# EAGLE design logic_translator (EAGLE 7.7.0)
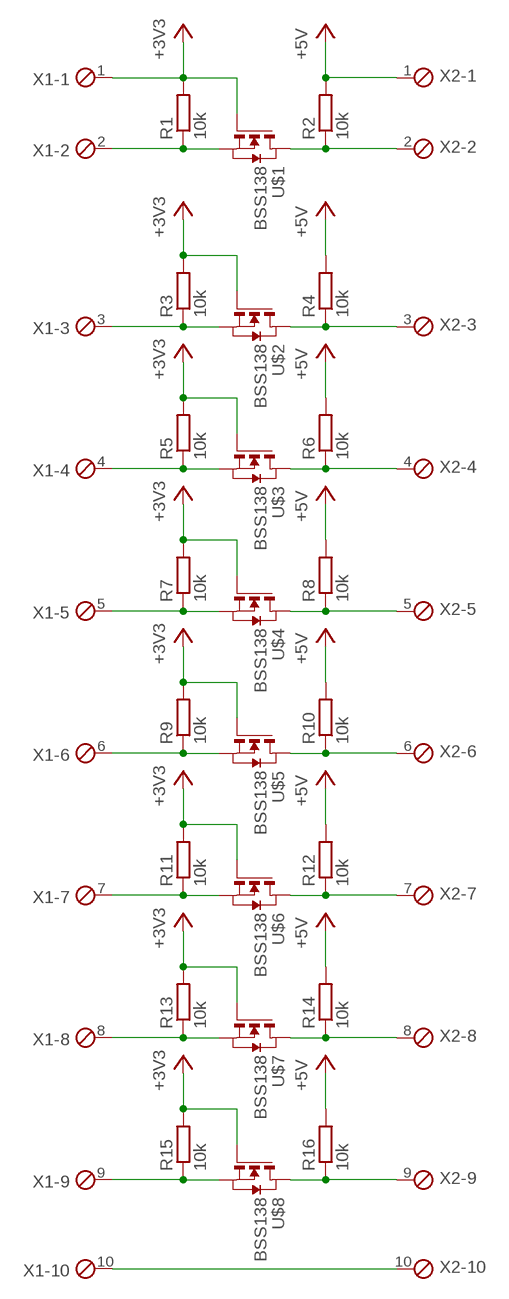
[diagram p0: schematic, sheet 1]

## Parts
R1  10k  R-EU_R1206  [R1206]
R2  10k  R-EU_R1206  [R1206]
R3  10k  R-EU_R1206  [R1206]
R4  10k  R-EU_R1206  [R1206]
R5  10k  R-EU_R1206  [R1206]
R6  10k  R-EU_R1206  [R1206]
R7  10k  R-EU_R1206  [R1206]
R8  10k  R-EU_R1206  [R1206]
R9  10k  R-EU_R1206  [R1206]
R10  10k  R-EU_R1206  [R1206]
R11  10k  R-EU_R1206  [R1206]
R12  10k  R-EU_R1206  [R1206]
R13  10k  R-EU_R1206  [R1206]
R14  10k  R-EU_R1206  [R1206]
R15  10k  R-EU_R1206  [R1206]
R16  10k  R-EU_R1206  [R1206]
U$1  BSS138  [SOT-23]
U$2  BSS138  [SOT-23]
U$3  BSS138  [SOT-23]
U$4  BSS138  [SOT-23]
U$5  BSS138  [SOT-23]
U$6  BSS138  [SOT-23]
U$7  BSS138  [SOT-23]
U$8  BSS138  [SOT-23]
X1  MPT10  [10POL254]
X2  MPT10  [10POL254]

## Nets
+3V3: R1.2 R3.2 R5.2 R7.2 R9.2 R11.2 R13.2 R15.2 U$1.3(G) U$2.3(G) U$3.3(G) U$4.3(G) U$5.3(G) U$6.3(G) U$7.3(G) U$8.3(G) X1.1
+5V: R2.2 R4.2 R6.2 R8.2 R10.2 R12.2 R14.2 R16.2 X2.1
N$1: R1.1 U$1.2(S) X1.2
N$2: R3.1 U$2.2(S) X1.3
N$3: R2.1 U$1.1(D) X2.2
N$4: R4.1 U$2.1(D) X2.3
N$5: R5.1 U$3.2(S) X1.4
N$6: R6.1 U$3.1(D) X2.4
N$7: R7.1 U$4.2(S) X1.5
N$8: R8.1 U$4.1(D) X2.5
N$9: R9.1 U$5.2(S) X1.6
N$10: R10.1 U$5.1(D) X2.6
N$11: R11.1 U$6.2(S) X1.7
N$12: R12.1 U$6.1(D) X2.7
N$13: R13.1 U$7.2(S) X1.8
N$14: R14.1 U$7.1(D) X2.8
N$15: R15.1 U$8.2(S) X1.9
N$16: R16.1 U$8.1(D) X2.9
N$17: X1.10 X2.10

## Library data of the parts
R1-R16 = rcl:R-EU_: RESISTOR, European symbol
U$1-U$8 = my_electronics_library:BSS138
X1 X2 = con-phoenix-254:MPT10: PHOENIX CONNECTOR; OC_FARNELL: unknown; OC_NEWARK: unknown

## Board
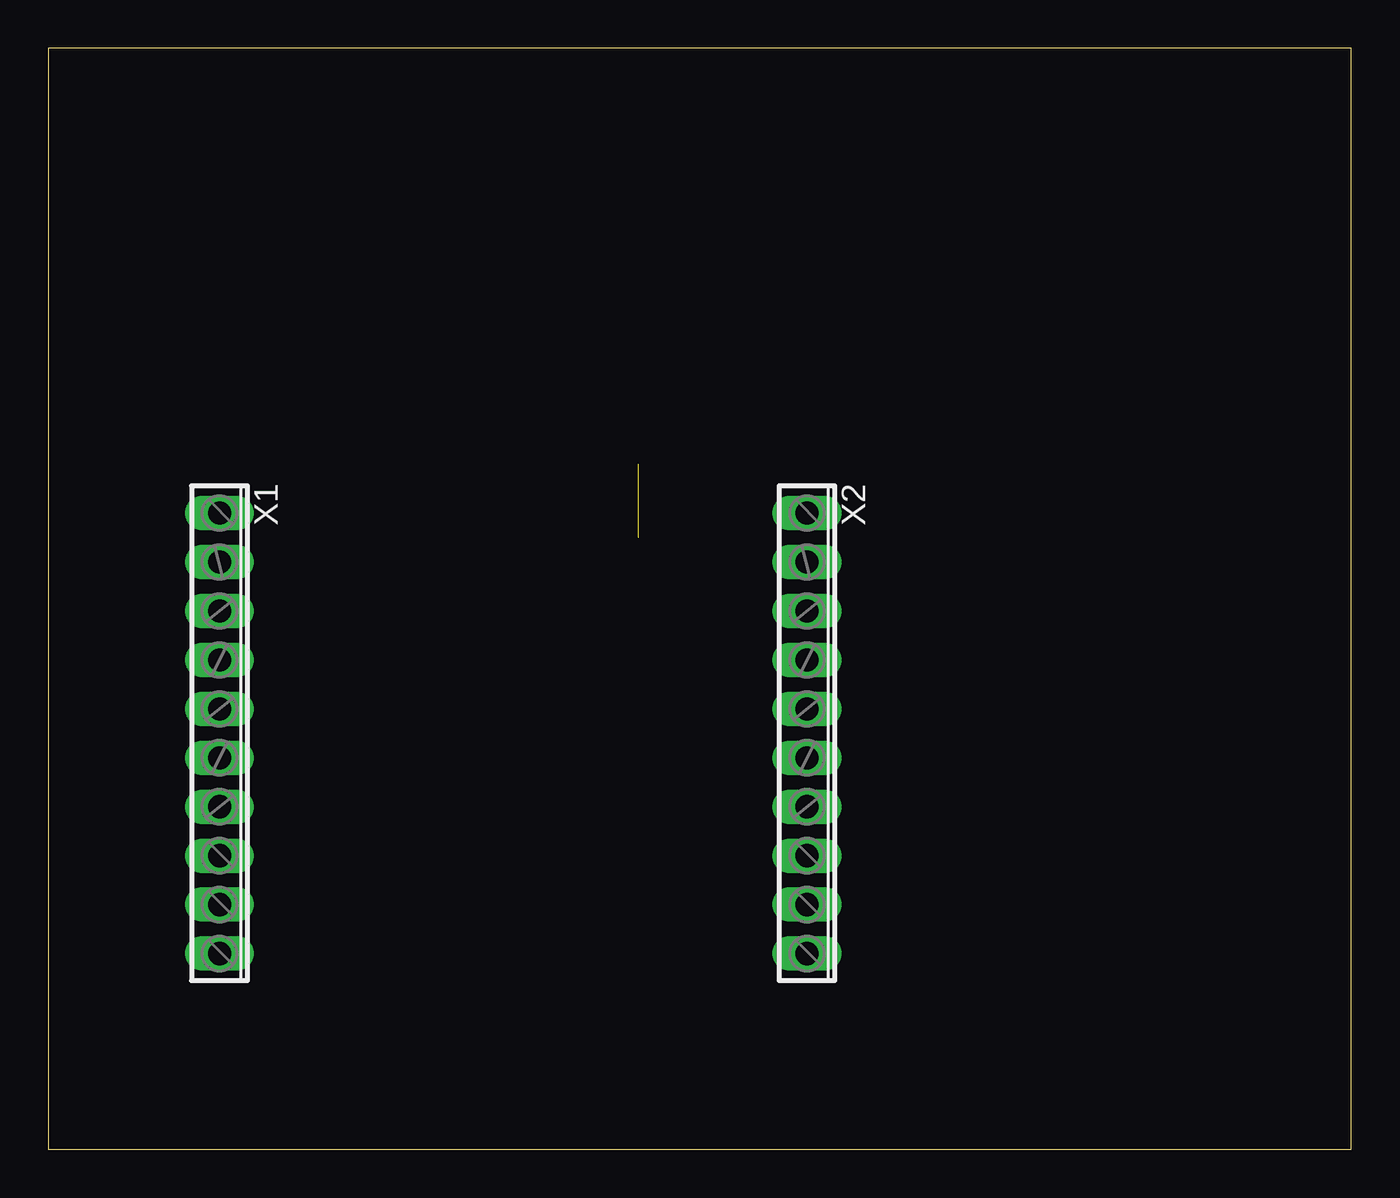
[diagram p1: board, top side]
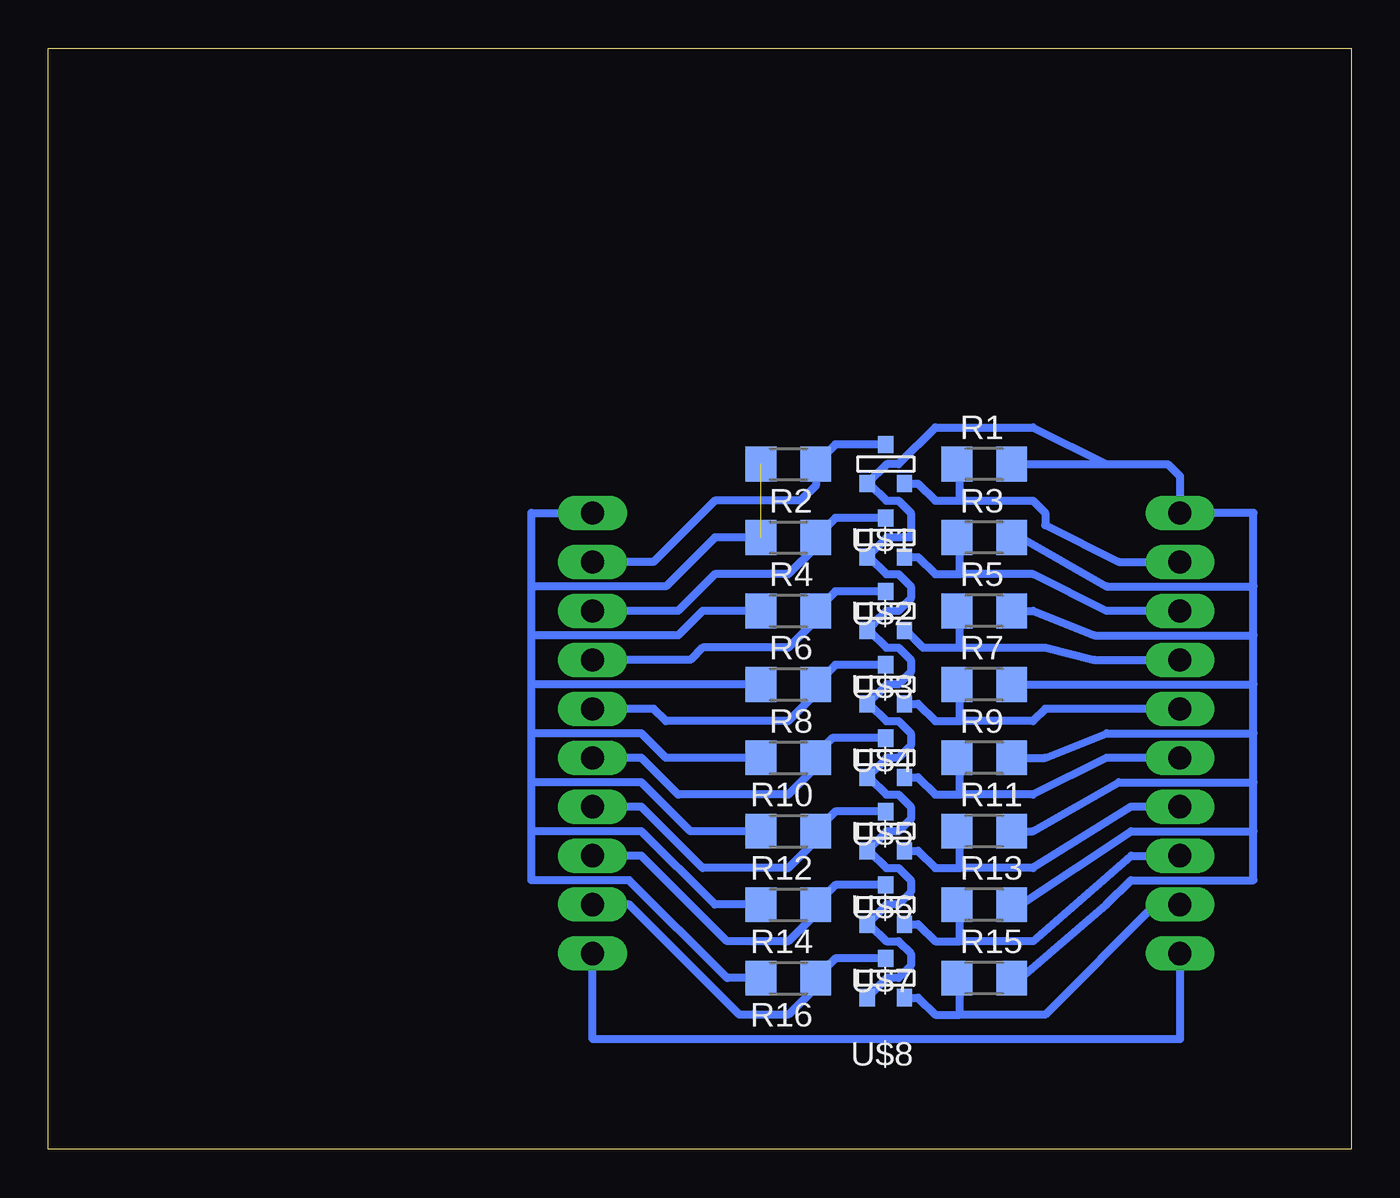
[diagram p2: board, bottom side, seen from below]

Size 67.61 x 57.14 mm. Coordinates in mm from the lower left corner, seen from the top.
Outline: 0,0 67.61,0 67.61,57.14 0,57.14 0,0
Copper layers (1*16): Top 0.035mm / dielectric 1.5mm / Bottom 0.035mm
Design rules "default": minimum track width 10mil, minimum drill 24mil, track to track 8mil, track to pad 8mil, pad to pad 8mil, via to via 8mil, smd to smd 8mil, copper to edge 40mil, drill to drill 8mil, minimum pad ring 10mil, minimum via ring 8mil, stop-mask expansion 4mil, vias tented up to drill 0mil, thermal gap 10mil

### Footprints (pad centres in the part's own frame; a part is rotated, then mirrored left to right if it is on the bottom)
R1206 = smd 1.6 x 1.803: 1 -1.422,0; 2 1.422,0
SOT-23 = smd 0.787 x 0.889: 1 0.025,-1.016; 2 -0.94,1.016; 3 0.991,1.016
10POL254 = drill 1.2 long: 1 -11.43,0; 2 -8.89,0; 3 -6.35,0; 4 -3.81,0; 5 -1.27,0; 6 1.27,0; 7 3.81,0; 8 6.35,0; 9 8.89,0; 10 11.43,0

### Placement (x,y rotation side)
R1  19.05,35.56 0 bottom
R2  29.21,35.56 180 bottom
R3  19.05,31.75 0 bottom
R4  29.21,31.75 180 bottom
R5  19.05,27.94 0 bottom
R6  29.21,27.94 180 bottom
R7  19.05,24.13 0 bottom
R8  29.21,24.13 180 bottom
R9  19.05,20.32 0 bottom
R10  29.21,20.32 180 bottom
R11  19.05,16.51 0 bottom
R12  29.21,16.51 180 bottom
R13  19.05,12.7 0 bottom
R14  29.21,12.7 180 bottom
R15  19.05,8.89 0 bottom
R16  29.21,8.89 180 bottom
U$1  24.13,35.56 180 bottom
U$2  24.13,31.75 180 bottom
U$3  24.13,27.94 180 bottom
U$4  24.13,24.13 180 bottom
U$5  24.13,20.32 180 bottom
U$6  24.13,16.51 180 bottom
U$7  24.13,12.7 180 bottom
U$8  24.13,8.89 180 bottom
X1  8.89,21.59 270 top
X2  39.37,21.59 270 top

### Tracks (layer width: path | path; a pad name or v marks a point on that pad's centre or on a via)
+3V3
  Bottom 0.406: U$8.3 24.11,8.89 23.5,8.89 22.86,9.53 22.86,10.16 23.5,10.79 24.13,10.79 25.02,11.68 U$7.3 24.13,12.68 24.13,12.7 23.5,12.7 22.86,13.34 22.86,13.97 23.5,14.61 24.13,14.61 25.02,15.49 U$6.3 24.13,16.48 24.13,16.51 23.5,16.51 22.86,17.14 22.86,17.78 23.5,18.41 24.13,18.41 25.02,19.3 U$5.3 24.13,20.3 24.13,20.32 23.5,20.32 22.86,20.95 22.86,21.59 23.5,22.23 24.13,22.23 25.02,23.11 U$4.3 24.11,24.13 23.5,24.13 22.86,24.77 22.86,25.4 23.5,26.04 24.13,26.04 25.02,26.92 U$3.3 24.77,27.28 24.77,27.3 24.13,27.94 23.5,27.94 22.86,28.57 22.86,29.21 23.5,29.84 24.13,29.84 25.02,30.73 U$2.3 24.11,31.75 22.86,31.75 22.86,33.02 23.5,33.66 24.13,33.66 25.02,34.54 U$1.3 24.11,35.56 23.5,35.56 21.59,37.47 16.51,37.47 12.7,35.56 | R3.2 17.14,31.75 12.7,29.21 5.08,29.21 | 5.08,29.21 5.08,33.02 X1.1 8.89,34.92 9.53,35.56 12.7,35.56 | R5.2 16.51,27.94 13.34,26.67 5.08,26.67 | 5.08,26.67 5.08,29.21 | R7.2 5.08,24.13 | 5.08,24.13 5.08,26.67 | R9.2 15.88,20.32 12.7,21.59 5.08,21.59 | 5.08,21.59 5.08,24.13 | R1.2 12.7,35.56 | R11.2 16.51,16.51 12.06,19.05 5.08,19.05 | 5.08,19.05 5.08,21.59 | R13.2 17.14,12.7 11.43,16.51 5.08,16.51 | 5.08,16.51 5.08,19.05 | R15.2 17.14,8.89 12.7,12.7 11.43,13.97 5.08,13.97 5.08,16.51
+5V  (1 unrouted)
  Bottom 0.406: R4.2 33.02,31.75 35.56,29.21 42.55,29.21 | 42.55,29.21 42.55,33.02 X2.1 | R8.2 42.55,24.13 | 42.55,24.13 42.55,26.67 | 42.55,26.67 42.55,29.21 | R6.2 33.66,27.94 34.92,26.67 42.55,26.67 | R10.2 35.56,20.32 36.83,21.59 42.55,21.59 | 42.55,21.59 42.55,24.13 | R12.2 34.29,16.51 36.83,19.05 42.55,19.05 | 42.55,19.05 42.55,21.59 | R14.2 33.02,12.7 36.83,16.51 42.55,16.51 | 42.55,16.51 42.55,19.05 | R16.2 32.38,8.89 37.47,13.97 42.55,13.97 42.55,16.51
N$1
  Bottom 0.406: 20.32,33.66 20.32,35.41 R1.1 | U$1.2 22.48,34.54 21.59,33.66 20.32,33.66 | 20.32,33.66 16.51,33.66 15.88,33.02 15.88,32.38 12.06,30.48 X1.2
N$2
  Bottom 0.406: 20.32,29.84 20.32,31.6 R3.1 20.32,31.75 | U$2.2 22.48,30.73 21.59,29.84 20.32,29.84 | X1.3 12.7,27.94 16.51,29.84 20.32,29.84
N$3
  Bottom 0.406: U$1.1 26.77,36.58 R2.1 27.79,34.44 28.57,33.66 33.02,33.66 36.2,30.48 X2.2
N$4
  Bottom 0.406: U$2.1 26.77,32.77 R4.1 27.79,31.27 29.21,29.84 33.02,29.84 34.92,27.94 X2.3
N$5
  Bottom 0.406: 20.32,26.04 20.32,27.79 R5.1 | U$3.2 23.11,26.92 22.23,26.04 20.32,26.04 | 20.32,26.04 15.88,26.04 13.34,25.4 X1.4
N$6
  Bottom 0.406: U$3.1 26.77,28.96 R6.1 27.79,27.46 29.21,26.04 33.66,26.04 34.29,25.4 X2.4
N$7
  Bottom 0.406: 20.32,22.23 20.32,23.98 R7.1 | U$4.2 22.48,23.11 21.59,22.23 20.32,22.23 | X1.5 15.88,22.86 16.51,22.23 20.32,22.23
N$8
  Bottom 0.406: U$4.1 26.77,25.15 R8.1 27.79,23.65 29.21,22.23 35.56,22.23 36.2,22.86 X2.5
N$9
  Bottom 0.406: 20.32,18.41 20.32,20.17 R9.1 | U$5.2 22.48,19.3 21.59,18.41 20.32,18.41 | X1.6 12.7,20.32 16.51,18.41 20.32,18.41
N$10
  Bottom 0.406: U$5.1 26.92,21.34 27.94,20.32 | 27.94,20.32 R10.1 | 27.94,20.32 27.94,19.68 29.21,18.41 34.92,18.41 36.83,20.32 X2.6
N$11
  Bottom 0.406: 20.32,14.61 20.32,16.36 R11.1 | U$6.2 22.48,15.49 21.59,14.61 20.32,14.61 | X1.7 11.43,17.78 16.51,14.61 20.32,14.61
N$12
  Bottom 0.406: U$6.1 26.77,17.53 R12.1 27.79,16.03 29.21,14.61 33.66,14.61 36.83,17.78 X2.7
N$13
  Bottom 0.406: 20.32,10.79 16.51,10.79 11.43,15.24 X1.8 | 20.32,10.79 20.32,12.55 R13.1 | U$7.2 22.48,11.68 21.59,10.79 20.32,10.79
N$14
  Bottom 0.406: U$7.1 26.77,13.72 R14.1 27.79,12.22 29.21,10.79 32.38,10.79 36.83,15.24 X2.8
N$15
  Bottom 0.406: 20.32,6.99 20.32,8.74 R15.1 | U$8.2 22.48,7.87 21.59,6.99 20.32,6.99 | X1.9 10.16,12.7 15.88,6.99 20.32,6.99
N$16
  Bottom 0.406: U$8.1 26.77,9.91 R16.1 27.79,8.41 29.21,6.99 31.75,6.99 37.47,12.7 X2.9
N$17
  Bottom 0.406: X1.10 8.89,5.71 39.37,5.71 X2.10